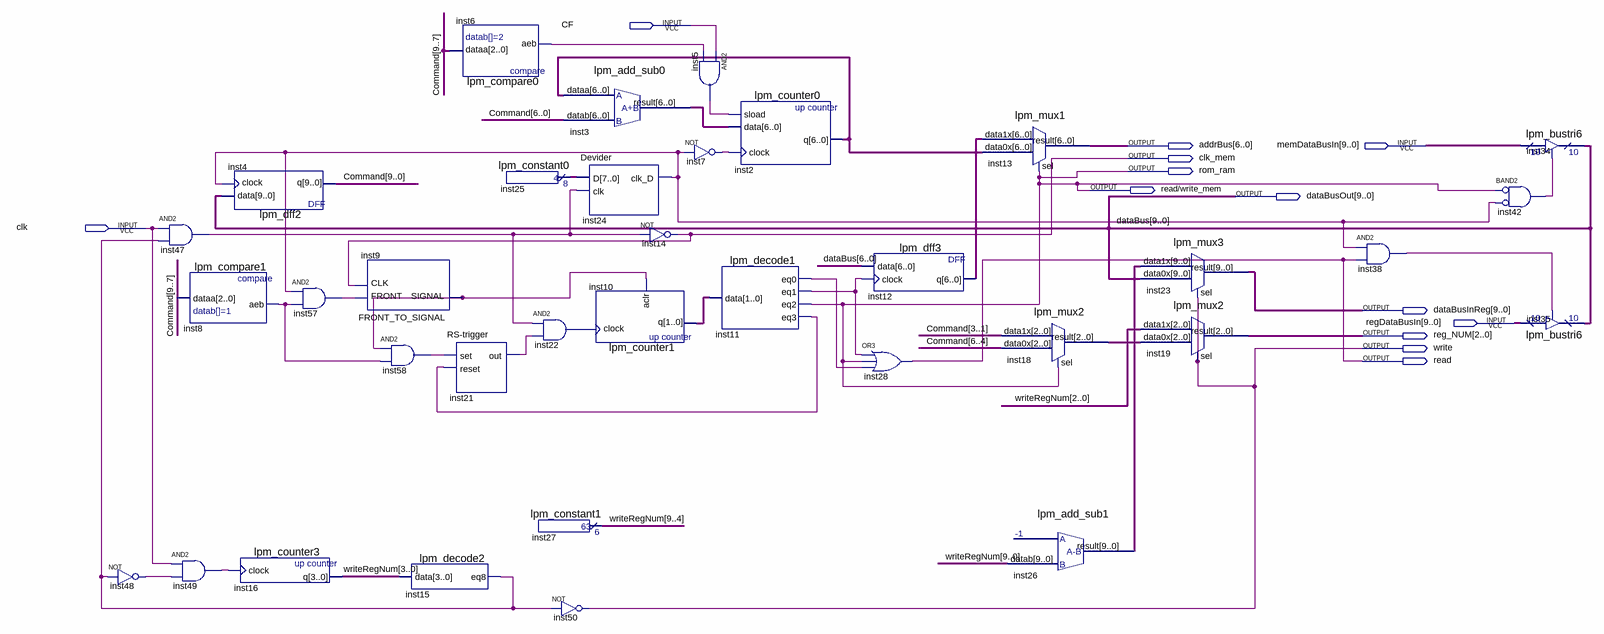
[diagram p0: schematic sheet]
// Quartus schematic Driver.bdf as structural Verilog: 35 symbols, 13 pins
module Driver (
  input  CF,
  input  [9:0] memDataBusIn,
  input  clk,
  input  [9:0] regDataBusIn,
  output [6:0] addrBus,
  output clk_mem,
  output rom_ram,
  output \read/write_mem ,
  output [9:0] dataBusOut,
  output [9:0] dataBusInReg,
  output [2:0] reg_NUM,
  output write,
  output read
);

  wire inst5_out, inst6_aeb, inst7_out, inst8_aeb, inst9_signal, inst11_eq0, inst11_eq1, inst11_eq3,
       inst15_eq8, inst21_out, inst22_out, inst24_clk_d, inst38_out, inst42_out, inst47_out, inst48_out,
       inst49_out, inst57_out, inst58_out;
  wire [1:0] inst10_q;
  wire [2:0] inst18_result;
  wire [6:0] inst2_q, inst3_result, inst12_q;
  wire [7:0] inst25_result;
  wire [9:0] Command, inst26_result, writeRegNum;

  not inst48 (inst48_out, inst15_eq8);
  and inst47 (inst47_out, clk, inst15_eq8);
  lpm_compare1 inst8 (.dataa(Command[9:7]), .aeb(inst8_aeb));
  and inst49 (inst49_out, clk, inst48_out);
  lpm_dff2 inst4 (.data(dataBusOut), .clock(inst24_clk_d), .q(Command));
  lpm_counter3 inst16 (.clock(inst49_out), .q(writeRegNum[3:0]));
  and inst57 (inst57_out, inst24_clk_d, inst8_aeb);
  FRONT_TO_SIGNAL inst9 (.FRONT(inst57_out), .CLK(clk_mem), .SIGNAL(inst9_signal));
  and inst58 (inst58_out, inst9_signal, inst8_aeb);
  lpm_decode2 inst15 (.data(writeRegNum[3:0]), .eq8(inst15_eq8));
  lpm_compare0 inst6 (.dataa(Command[9:7]), .aeb(inst6_aeb));
  \RS-trigger  inst21 (.set(inst58_out), .reset(inst11_eq3), .out(inst21_out));
  lpm_constant0 inst25 (.result(inst25_result));
  lpm_add_sub0 inst3 (.dataa(inst2_q), .datab(Command[6:0]), .result(inst3_result));
  and inst22 (inst22_out, inst47_out, inst21_out);
  lpm_constant1 inst27 (.result(writeRegNum[9:4]));
  not inst50 (write, inst15_eq8);
  Devider inst24 (.D(inst25_result), .clk(inst47_out), .clk_D(inst24_clk_d));
  lpm_counter1 inst10 (.clock(inst22_out), .aclr(inst9_signal), .q(inst10_q));
  not inst14 (clk_mem, inst47_out);
  and inst5 (inst5_out, CF, inst6_aeb);
  not inst7 (inst7_out, inst24_clk_d);
  lpm_decode1 inst11 (.data(inst10_q), .eq0(inst11_eq0), .eq1(inst11_eq1), .eq2(\read/write_mem ), .eq3(inst11_eq3));
  lpm_counter0 inst2 (.sload(inst5_out), .data(inst3_result), .clock(inst7_out), .q(inst2_q));
  lpm_dff3 inst12 (.data(dataBusOut[6:0]), .clock(inst11_eq1), .q(inst12_q));
  or inst28 (read, inst11_eq1, \read/write_mem , inst11_eq0);
  lpm_mux1 inst13 (.data1x(inst12_q), .data0x(inst2_q), .sel(\read/write_mem ), .result(addrBus));
  lpm_mux2 inst18 (.data1x(Command[3:1]), .data0x(Command[6:4]), .sel(\read/write_mem ), .result(inst18_result));
  lpm_add_sub1 inst26 (.datab(writeRegNum), .result(inst26_result));
  lpm_mux3 inst23 (.data1x(inst26_result), .data0x(dataBusOut), .sel(write), .result(dataBusInReg));
  lpm_mux2 inst19 (.data1x(writeRegNum[2:0]), .data0x(inst18_result), .sel(write), .result(reg_NUM));
  and inst38 (inst38_out, inst24_clk_d, read);
  lpm_bustri6 inst34 (.enabledt(inst42_out), .data(memDataBusIn), .tridata(dataBusOut));
  and inst42 (inst42_out, ~\read/write_mem , ~inst24_clk_d);  // BAND2
  lpm_bustri6 inst35 (.enabledt(inst38_out), .data(regDataBusIn), .tridata(dataBusOut));

  assign rom_ram = \read/write_mem ;

  // Other names for the same wires on the sheet: dataBus[9:0] = dataBusOut
endmodule
